# EAGLE design GBMx4-CPU (EAGLE 5.10)
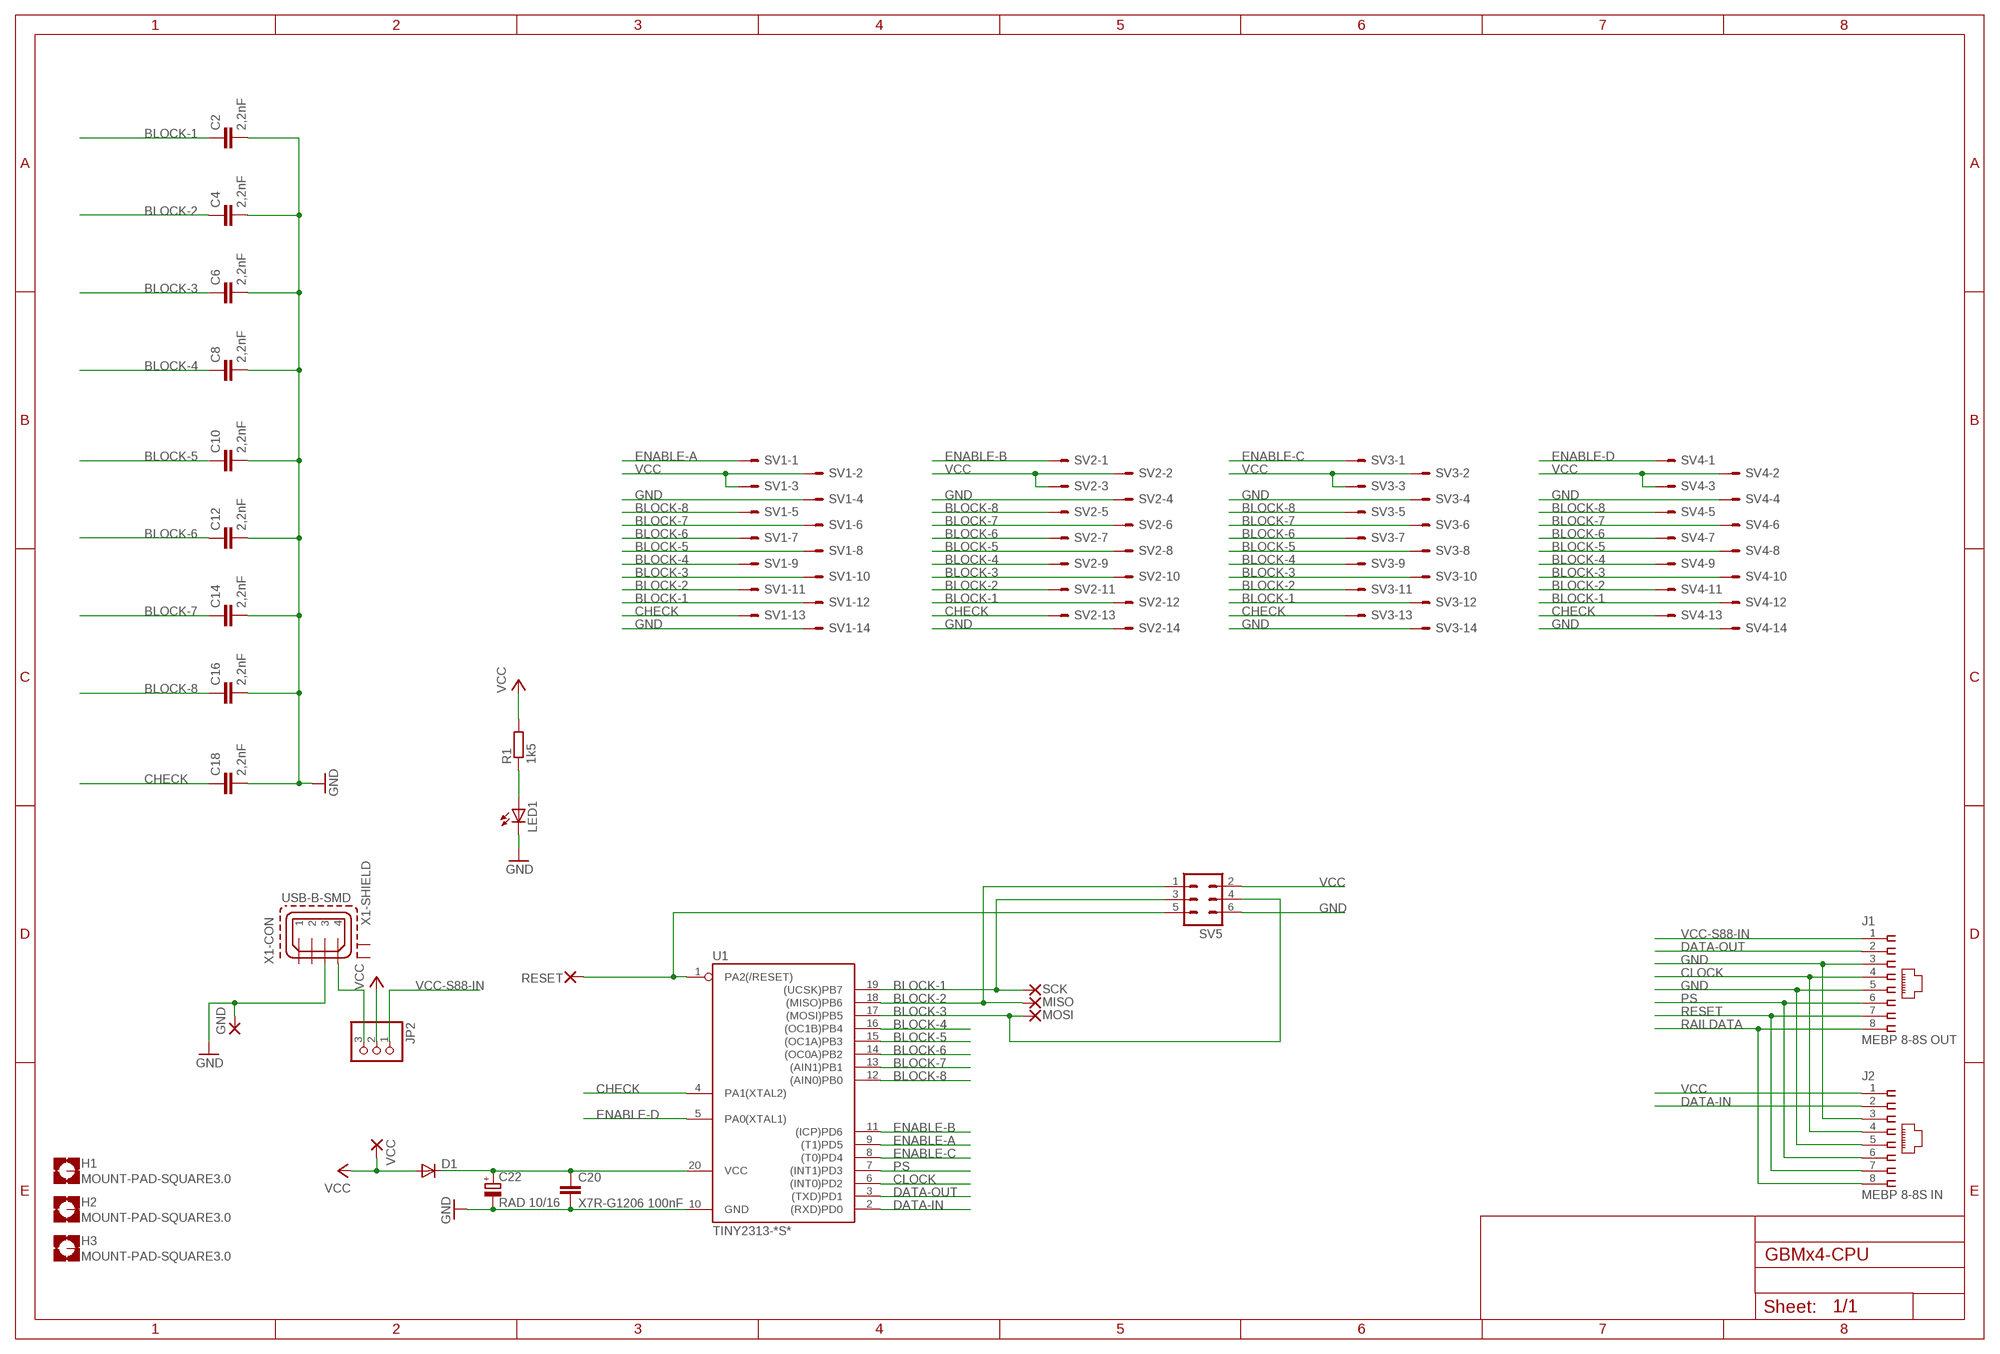
[diagram p0: schematic, sheet 1]

## Parts
C2  2,2nF  C-EUC1206  [C1206]
C4  2,2nF  C-EUC1206  [C1206]
C6  2,2nF  C-EUC1206  [C1206]
C8  2,2nF  C-EUC1206  [C1206]
C10  2,2nF  C-EUC1206  [C1206]
C12  2,2nF  C-EUC1206  [C1206]
C14  2,2nF  C-EUC1206  [C1206]
C16  2,2nF  C-EUC1206  [C1206]
C18  2,2nF  C-EUC1206  [C1206]
C20  X7R-G1206 100nF  C-EUC1206  [C1206]
C22  RAD 10/16  CPOL-EUE2.5-6  [E2,5-6]
D1  DIODE-MINIMELF  [MINIMELF]
GND  SMD2  [SMD1,27-2,54]
H1  MOUNT-PAD-SQUARE3.0  [3,0-PAD-SQUARE]
H2  MOUNT-PAD-SQUARE3.0  [3,0-PAD-SQUARE]
H3  MOUNT-PAD-SQUARE3.0  [3,0-PAD-SQUARE]
J1  MEBP 8-8S OUT  555162-1  [555162-1]
J2  MEBP 8-8S IN  555162-1  [555162-1]
JP2  PINHD-1X3  [1X03]
LED1  LED3MM  [LED3MM]
MISO  SMD2  [SMD1,27-2,54]
MOSI  SMD2  [SMD1,27-2,54]
R1  1k5  R-EU_R1206  [R1206]
RESET  SMD2  [SMD1,27-2,54]
SCK  SMD2  [SMD1,27-2,54]
SV1  ML14E  [ML14]
SV2  ML14E  [ML14]
SV3  ML14E  [ML14]
SV4  ML14E  [ML14]
SV5  ML6  [ML6]
U1  TINY2313-*S*  [SO20L$]
VCC  SMD2  [SMD1,27-2,54]
X1  USB-B-SMD  [USB-B-SMD]

## Nets
BLOCK-1: C2.1 SCK.1(P) SV1.12 SV2.12 SV3.12 SV4.12 SV5.3 U1.19((UCSK)PB7)
BLOCK-2: C4.1 MISO.1(P) SV1.11 SV2.11 SV3.11 SV4.11 SV5.1 U1.18((MISO)PB6)
BLOCK-3: C6.1 MOSI.1(P) SV1.10 SV2.10 SV3.10 SV4.10 SV5.4 U1.17((MOSI)PB5)
BLOCK-4: C8.1 SV1.9 SV2.9 SV3.9 SV4.9 U1.16((OC1B)PB4)
BLOCK-5: C10.1 SV1.8 SV2.8 SV3.8 SV4.8 U1.15((OC1A)PB3)
BLOCK-6: C12.1 SV1.7 SV2.7 SV3.7 SV4.7 U1.14((OC0A)PB2)
BLOCK-7: C14.1 SV1.6 SV2.6 SV3.6 SV4.6 U1.13((AIN1)PB1)
BLOCK-8: C16.1 SV1.5 SV2.5 SV3.5 SV4.5 U1.12((AIN0)PB0)
CHECK: C18.1 SV1.13 SV2.13 SV3.13 SV4.13 U1.4(PA1(XTAL2))
CLOCK: J1.4 J2.4 U1.6((INT0)PD2)
DATA-IN: J2.2 U1.2((RXD)PD0)
DATA-OUT: J1.2 U1.3((TXD)PD1)
ENABLE-A: SV1.1 U1.9((T1)PD5)
ENABLE-B: SV2.1 U1.11((ICP)PD6)
ENABLE-C: SV3.1 U1.8((T0)PD4)
ENABLE-D: SV4.1 U1.5(PA0(XTAL1))
GND: C2.2 C4.2 C6.2 C8.2 C10.2 C12.2 C14.2 C16.2 C18.2 C20.2 C22.- GND.1(P) J1.3 J1.5 J2.3 J2.5 LED1.K(C) SV1.4 SV1.14 SV2.4 SV2.14 SV3.4 SV3.14 SV4.4 SV4.14 SV5.6 U1.10(GND) X1.3
N$1: RESET.1(P) SV5.5 U1.1(PA2(/RESET))
N$2: LED1.A R1.1
N$8: C20.1 C22.+ D1.C U1.20(VCC)
PS: J1.6 J2.6 U1.7((INT1)PD3)
RAILDATA: J1.8 J2.8
RESET: J1.7 J2.7
VCC: D1.A J2.1 JP2.2 R1.2 SV1.2 SV1.3 SV2.2 SV2.3 SV3.2 SV3.3 SV4.2 SV4.3 SV5.2 VCC.1(P)
VCC-EXT: JP2.3 X1.4
VCC-S88-IN: J1.1 JP2.1
Unconnected: H1.B3,0(MOUNT) H2.B3,0(MOUNT) H3.B3,0(MOUNT) X1.1 X1.2 X1.M1(-SHIELD:S1) X1.M2(-SHIELD:S2)

## Library data of the parts
C2 C4 C6 C8 C10 C12 C14 C16 C18 C20 = rcl:C-EU: CAPACITOR, European symbol
C22 = rcl:CPOL-EU: POLARIZED CAPACITOR, European symbol
D1 = diode:DIODE-: DIODE
GND MISO MOSI RESET SCK VCC = wirepad:SMD2: SMD PAD
H1-H3 = holes:MOUNT-PAD-SQUARE: MOUNTING PAD, square
J1 J2 = con-amp:555162-1: AMP connector
JP2 = pinhead:PINHD-1X3: PIN HEADER
LED1 = led:LED: LED OSRAM: - CHIPLED LG R971, LG N971, LY N971, LG Q971, LY Q971, LO R971, LY R971 LH N974, LH R974 LS Q976, LO Q976, LY Q976 LO Q996 - Hyper CHIPLED LW Q18S LB Q993, LB Q99A, LB R99A - SideLED LS A670, LO A670, LY A670, LG A670, LP A670 LB A673, LV A673, LT A673, LW A673 LH A674 LY A675 LS A676, LA A676, LO A676, LY A676, LW A676 LS A679, LY A679, LG A679 - Hyper Micro SIDELED® LS Y876, LA Y876, LO Y876, LY Y876 LT Y87S - SmartLED LW L88C, LW L88S LB L89C, LB L89S, LG L890 LS L89K, LO L89K, LY L89K LS L896, LA L896, LO L896, LY L896 - TOPLED LS T670, LO T670, LY T670, LG T670, LP T670 LSG T670, LSP T670, LSY T670, LOP T670, LYG T670 LG T671, LOG T671, LSG T671 LB T673, LV T673, LT T673, LW T673 LH T674 LS T676, LA T676, LO T676, LY T676, LB T676, LH T676, LSB T676, LW T676 LB T67C, LV T67C, LT T67C, LS T67K, LO T67K, LY T67K, LW E67C LS E67B, LA E67B, LO E67B, LY E67B, LB E67C, LV E67C, LT E67C LW T67C LS T679, LY T679, LG T679 LS T770, LO T770, LY T770, LG T770, LP T770 LB T773, LV T773, LT T773, LW T773 LH T774 LS E675, LA E675, LY E675, LS T675 LS T776, LA T776, LO T776, LY T776, LB T776 LHGB T686 LT T68C, LB T68C - Hyper Mini TOPLED® LB M676 - Mini TOPLED Santana® LG M470 LS M47K, LO M47K, LY M47K Source: http://www.osram.convergy.de LUXEON: - LUMILED® LXK2-PW12-R00, LXK2-PW12-S00, LXK2-PW14-U00, LXK2-PW14-V00 LXK2-PM12-R00, LXK2-PM12-S00, LXK2-PM14-U00 LXK2-PE12-Q00, LXK2-PE12-R00, LXK2-PE12-S00, LXK2-PE14-T00, LXK2-PE14-U00 LXK2-PB12-K00, LXK2-PB12-L00, LXK2-PB12-M00, LXK2-PB14-N00, LXK2-PB14-P00, LXK2-PB14-Q00 LXK2-PR12-L00, LXK2-PR12-M00, LXK2-PR14-Q00, LXK2-PR14-R00 LXK2-PD12-Q00, LXK2-PD12-R00, LXK2-PD12-S00 LXK2-PH12-R00, LXK2-PH12-S00 LXK2-PL12-P00, LXK2-PL12-Q00, LXK2-PL12-R00 Source: www.luxeon.com KINGBRIGHT: KA-3528ASYC Source: www.kingbright.com
R1 = rcl:R-EU_: RESISTOR, European symbol
SV1-SV4 = con-ml:ML14E: HARTING
SV5 = con-ml:ML6: HARTING
U1 = avr-6:TINY2313*: Atmel Tiny2313 2K Flash, 128 bytes EEPROM, 128 bytes RAM
X1 = 1_USER:USB-B-SMD

## Board
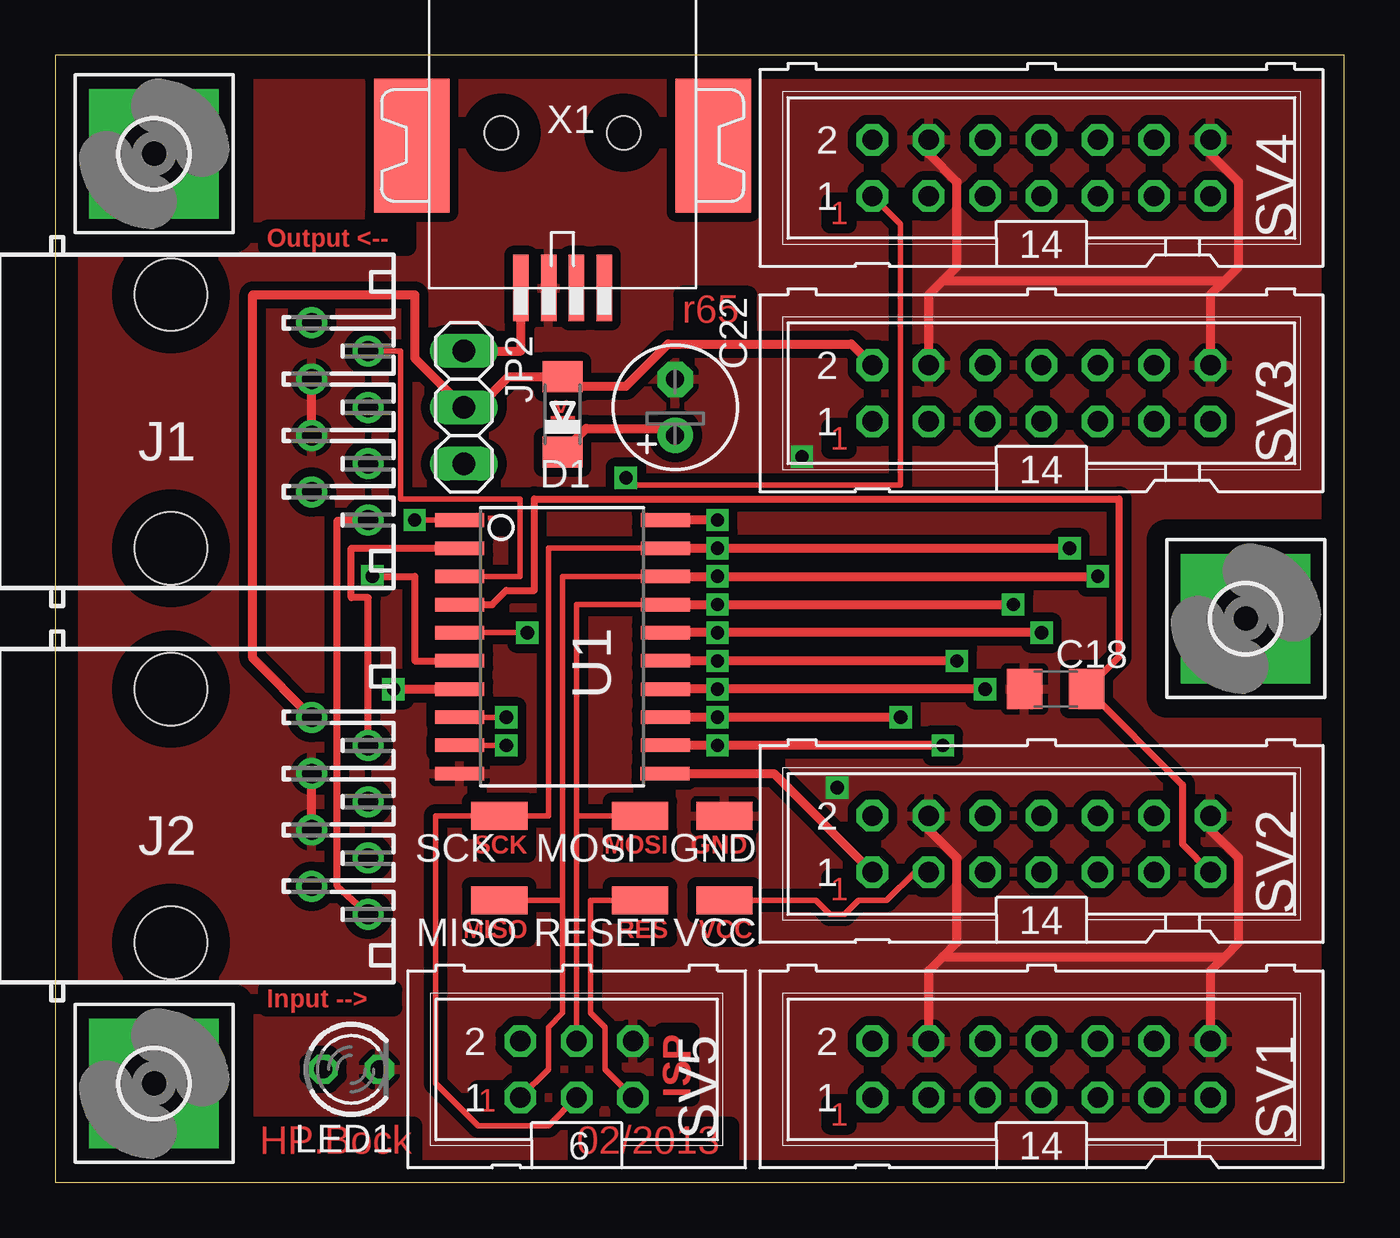
[diagram p1: board, top side]
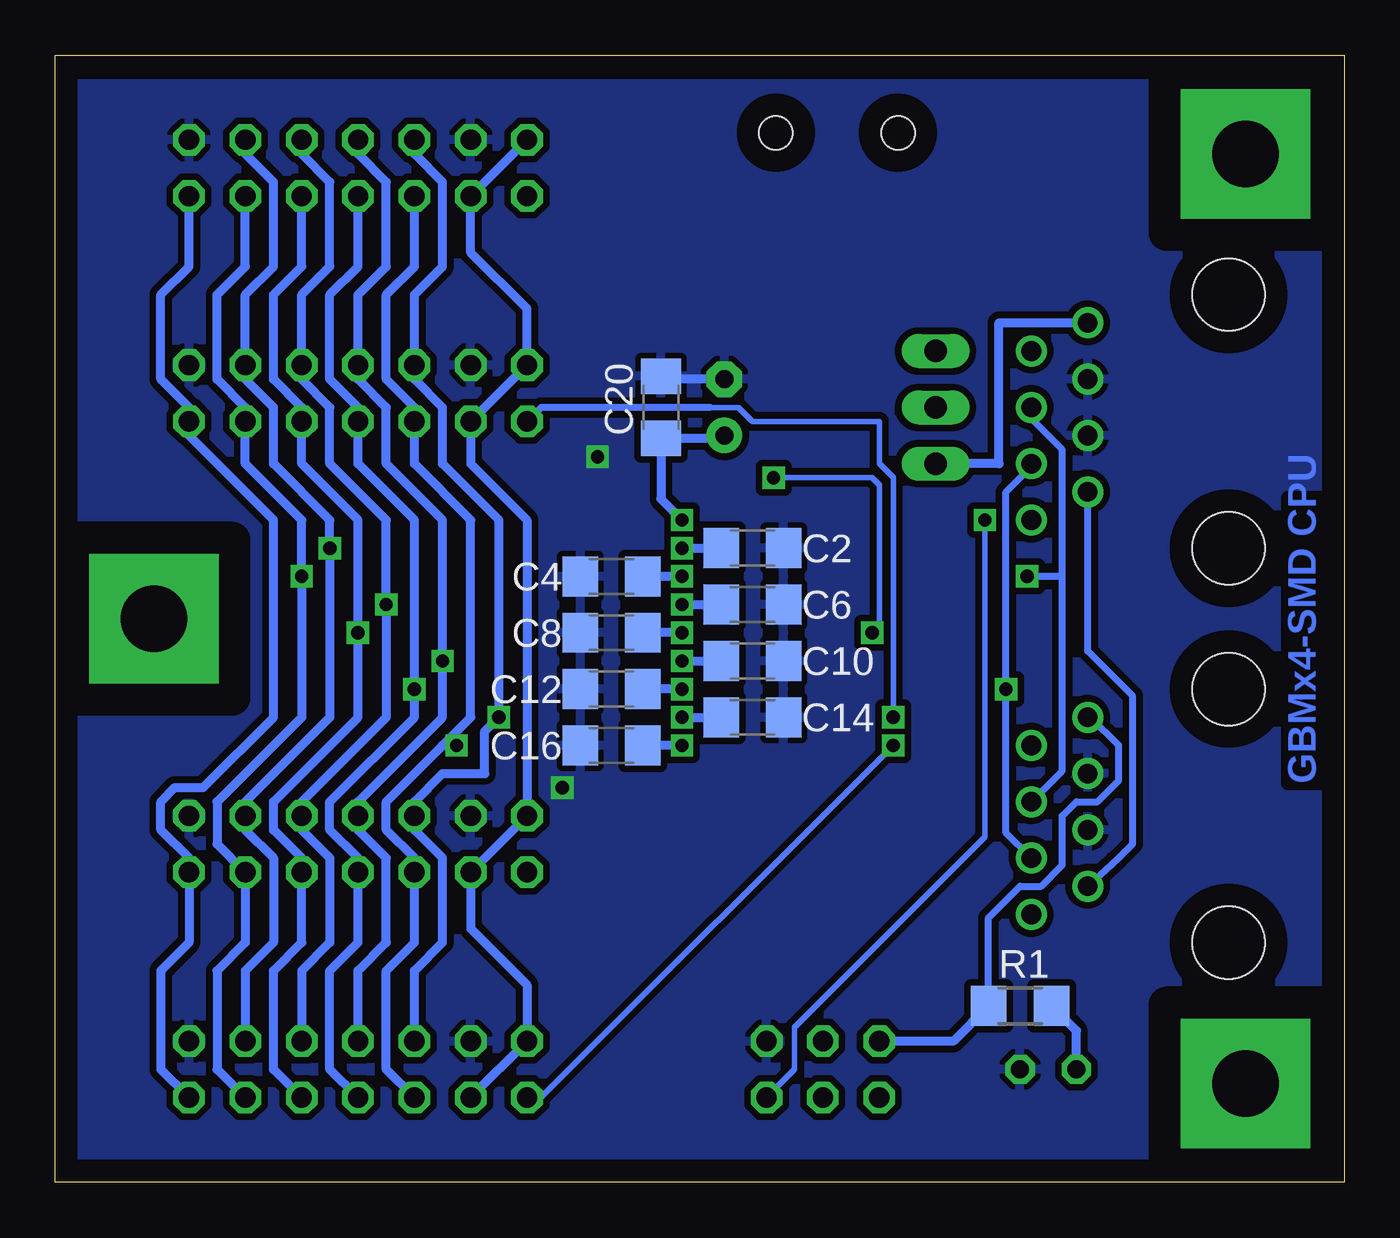
[diagram p2: board, bottom side, seen from below]

Size 58.09 x 50.79 mm. Coordinates in mm from the lower left corner, seen from the top.
Outline: 0,0 58.09,0 58.09,50.79 0,50.79 0,0
Copper layers (1*16): Top 0.035mm / dielectric 1.5mm / Bottom 0.035mm
Design rules "Bilex DRU": minimum track width 10mil, minimum drill 24mil, track to track 10mil, track to pad 10mil, pad to pad 10mil, via to via 10mil, smd to smd 10mil, copper to edge 40mil, drill to drill 8mil, minimum pad ring 10mil, minimum via ring 8mil, stop-mask expansion 4mil, vias tented up to drill 0mil, thermal gap 10mil

### Footprints (pad centres in the part's own frame; a part is rotated, then mirrored left to right if it is on the bottom)
C1206 = smd 1.6 x 1.8: 1 -1.4,0; 2 1.4,0
E2,5-6 = drill 0.813 pad 1.6 round: + -1.27,0 | drill 0.813 pad 1.6 octagon: - 1.27,0
MINIMELF = smd 1.4 x 1.8: A 1.7,0; C -1.7,0
SMD1,27-2,54 = smd 1.27 x 2.54: 1 0,0
3,0-PAD-SQUARE = drill 3 pad 5.842 square: B3,0 0,0
555162-1 = drill 0.889 round: 1 -4.445,5.207; 2 -3.175,7.747; 3 -1.905,5.207; 4 -0.635,7.747; 5 0.635,5.207; 6 1.905,7.747; 7 3.175,5.207; 8 4.445,7.747 | hole 3.251: -5.715,-1.143; 5.715,-1.143
1X03 = drill 1.016 long: 1 -2.54,0; 2 0,0; 3 2.54,0
LED3MM = drill 0.813 octagon: A -1.27,0; K 1.27,0
R1206 = smd 1.6 x 1.803: 1 -1.422,0; 2 1.422,0
ML14 = drill 0.914 octagon: 1 -7.62,-1.27; 2 -7.62,1.27; 3 -5.08,-1.27; 4 -5.08,1.27; 5 -2.54,-1.27; 6 -2.54,1.27; 7 0,-1.27; 8 0,1.27; 9 2.54,-1.27; 10 2.54,1.27; 11 5.08,-1.27; 12 5.08,1.27; 13 7.62,-1.27; 14 7.62,1.27
ML6 = drill 0.914 octagon: 1 -2.54,-1.27; 2 -2.54,1.27; 3 0,-1.27; 4 0,1.27; 5 2.54,-1.27; 6 2.54,1.27
SO20L$ = smd 0.61 x 2.21: 1 -5.715,-4.636; 2 -4.445,-4.636; 3 -3.175,-4.636; 4 -1.905,-4.636; 5 -0.635,-4.636; 6 0.635,-4.636; 7 1.905,-4.636; 8 3.175,-4.636; 9 4.445,-4.636; 10 5.715,-4.636; 11 5.715,4.61; 12 4.445,4.636; 13 3.175,4.636; 14 1.905,4.636; 15 0.635,4.636; 16 -0.635,4.636; 17 -1.905,4.636; 18 -3.175,4.636; 19 -4.445,4.636; 20 -5.715,4.636
USB-B-SMD = smd 3 x 0.7: 1 7,1.875; 2 7,0.625; 3 7,-0.625; 4 7,-1.875 | smd 6.04 x 3.4: M1 0.58,-6.8; M2 0.58,6.8 | hole 1.5: 0,-2.75; 0,2.75

### Placement (x,y rotation side)
C2  26.67,28.57 0 bottom
C4  33.02,27.3 180 bottom
C6  26.67,26.04 0 bottom
C8  33.02,24.77 180 bottom
C10  26.67,23.5 0 bottom
C12  33.02,22.23 180 bottom
C14  26.67,20.95 0 bottom
C16  33.02,19.68 180 bottom
C18  45.09,22.23 180 top
C20  30.8,34.92 90 bottom
C22  27.94,34.92 90 top
D1  22.86,34.61 90 top
GND  30.16,16.51 90 top
H1  4.45,46.35 0 top
H2  53.66,25.4 0 top
H3  4.45,4.45 0 top
J1  6.35,34.29 270 top
J2  6.35,16.51 270 top
JP2  18.41,34.92 90 top
LED1  13.34,5.08 0 top
MISO  20,12.7 90 top
MOSI  26.35,16.51 90 top
R1  14.61,7.94 180 bottom
RESET  26.35,12.7 90 top
SCK  20,16.51 90 top
SV1  44.45,5.08 0 top
SV2  44.45,15.24 0 top
SV3  44.45,35.56 0 top
SV4  44.45,45.72 0 top
SV5  23.5,5.08 0 top
U1  22.86,24.13 270 top
VCC  30.16,12.7 90 top
X1  22.86,47.31 270 top

### Tracks (layer width: path | path; a pad name or v marks a point on that pad's centre or on a via)
BLOCK-1  (via drill 0.6)
  Top 0.254: U1.19 22.23,28.57 22.23,16.51 SCK.1 17.14,16.51 17.14,4.45 19.05,2.54 22.23,2.54 SV5.3
  Top 0.406: U1.19 v29.84,28.57 v45.72,28.57
  Bottom 0.406: SV1.12 49.53,9.53 48.26,10.79 48.26,14.61 49.53,15.88 SV2.12 49.53,17.14 45.72,20.95 v45.72,28.57 45.72,29.84 48.26,32.38 48.26,34.92 49.53,36.2 SV3.12 49.53,40.01 48.26,41.27 48.26,45.09 49.53,46.35 SV4.12 | v29.84,28.57 C2.1
BLOCK-2  (via drill 0.6)
  Top 0.254: U1.18 22.86,27.3 22.86,12.7 | 22.86,12.7 22.86,7.62 22.23,6.99 22.23,5.08 SV5.1 | 22.86,12.7 MISO.1
  Top 0.406: U1.18 v29.84,27.3 v46.99,27.3
  Bottom 0.406: SV1.11 50.8,5.08 50.8,9.53 49.53,10.79 SV2.11 50.8,15.24 50.8,17.14 46.99,20.95 v46.99,27.3 46.99,29.84 49.53,32.38 SV3.11 49.53,34.92 50.8,36.2 50.8,40.01 49.53,41.27 SV4.11 | v29.84,27.3 C4.1
BLOCK-3  (via drill 0.6)
  Top 0.254: U1.17 23.5,26.04 23.5,16.51 | SV5.4 23.5,16.51 | 23.5,16.51 MOSI.1
  Top 0.406: U1.17 v29.84,26.04 v43.18,26.04
  Bottom 0.406: SV1.10 46.99,9.53 45.72,10.79 45.72,14.61 46.99,15.88 SV2.10 46.99,17.14 43.18,20.95 v43.18,26.04 43.18,29.84 45.72,32.38 45.72,34.92 46.99,36.2 SV3.10 46.99,40.01 45.72,41.27 45.72,45.09 46.99,46.35 SV4.10 | v29.84,26.04 C6.1
BLOCK-4  (via drill 0.6)
  Top 0.406: U1.16 v29.84,24.77 v44.45,24.77
  Bottom 0.406: SV1.9 48.26,5.08 48.26,9.53 46.99,10.79 SV2.9 46.99,14.61 48.26,15.88 48.26,17.14 44.45,20.95 v44.45,24.77 44.45,29.84 46.99,32.38 SV3.9 46.99,34.92 48.26,36.2 48.26,40.01 46.99,41.27 SV4.9 | v29.84,24.77 C8.1
BLOCK-5  (via drill 0.6)
  Top 0.406: U1.15 v29.84,23.5 v40.64,23.5
  Bottom 0.406: SV1.8 44.45,9.53 43.18,10.79 43.18,14.61 44.45,15.88 SV2.8 44.45,17.14 40.64,20.95 v40.64,23.5 40.64,29.84 43.18,32.38 43.18,34.92 44.45,36.2 SV3.8 44.45,40.01 43.18,41.27 43.18,45.09 44.45,46.35 SV4.8 | v29.84,23.5 C10.1
BLOCK-6  (via drill 0.6)
  Top 0.406: U1.14 v29.84,22.23 v41.91,22.23
  Bottom 0.406: SV1.7 45.72,5.08 45.72,9.53 44.45,10.79 SV2.7 44.45,14.61 45.72,15.88 45.72,17.14 41.91,20.95 v41.91,22.23 41.91,29.84 44.45,32.38 SV3.7 44.45,34.92 45.72,36.2 45.72,40.01 44.45,41.27 SV4.7 | v29.84,22.23 C12.1
BLOCK-7  (via drill 0.6)
  Top 0.406: U1.13 v29.84,20.95 v38.1,20.95
  Bottom 0.406: SV1.6 41.91,9.53 40.64,10.79 40.64,14.61 41.91,15.88 SV2.6 41.91,17.14 40.64,18.41 38.73,18.41 38.73,20.32 v38.1,20.95 38.1,29.84 40.64,32.38 40.64,34.92 41.91,36.2 SV3.6 41.91,40.01 40.64,41.27 40.64,45.09 41.91,46.35 SV4.6 | v29.84,20.95 C14.1
BLOCK-8  (via drill 0.6)
  Top 0.406: U1.12 v29.84,19.68 v40.01,19.68
  Bottom 0.406: SV1.5 43.18,5.08 43.18,9.53 41.91,10.79 SV2.5 41.91,14.61 43.18,15.88 43.18,17.14 40.64,19.68 | SV4.5 41.91,41.27 43.18,40.01 43.18,36.2 41.91,34.92 SV3.5 41.91,32.38 39.37,29.84 39.37,20.95 40.64,19.68 | v29.84,19.68 C16.1 | 40.64,19.68 v40.01,19.68
CHECK
  Top 0.305: U1.4 19.68,26.04 20.32,26.67 21.59,26.67 21.59,30.8 47.94,30.8 47.94,23.68 C18.1 50.8,17.91 50.8,15.24 SV2.13
  Bottom 0.406: SV1.13 53.34,5.08 53.34,9.53 52.07,10.79 SV2.13 52.07,14.61 53.34,15.88 53.34,17.14 52.7,17.78 51.44,17.78 48.26,20.95 48.26,29.84 52.07,33.66 SV3.13 52.07,34.92 53.34,36.2 53.34,40.01 52.07,41.27 SV4.13
CLOCK  (via drill 0.6)
  Top 0.305: v14.29,27.3 16.19,27.3 16.19,23.5 U1.6
  Bottom 0.305: J2.4 12.7,18.54 12.7,27.3 | 12.7,27.3 12.7,33.02 14.1,34.42 J1.4 | 12.7,27.3 v14.29,27.3
DATA-IN
  Top 0.305: J2.2 14.1,26.35 13.34,26.35 13.34,28.57 U1.2
DATA-OUT
  Top 0.254: J1.2 15.56,37.47 15.56,30.8 20.95,30.8 20.95,27.3 U1.3
ENABLE-A  (via drill 0.6)
  Top 0.254: U1.9 v20.32,19.68
  Bottom 0.254: v20.32,19.68 36.2,3.81 SV1.1
ENABLE-B
  Top 0.406: SV2.1 32.38,18.41 U1.11
ENABLE-C  (via drill 0.6)
  Top 0.254: U1.8 v20.32,20.95
  Bottom 0.254: 28.57,34.92 27.3,34.92 26.67,34.29 20.95,34.29 20.95,32.38 20.32,31.75 v20.32,20.95
  Bottom 0.305: 28.57,34.92 36.2,34.92 SV3.1
ENABLE-D  (via drill 0.6)
  Top 0.254: SV4.1 38.1,43.18 38.1,31.43 26.04,31.43 v25.72,31.75 | U1.5 v21.27,24.77
  Bottom 0.254: v21.27,24.77 20.95,25.08 20.95,31.43 21.27,31.75 v25.72,31.75
GND  (via drill 0.6)
  Top 0.406: SV1.4 39.37,9.53 40.01,10.16 | SV2.4 39.37,15.88 40.64,14.61 40.64,10.79 40.01,10.16 | SV1.14 52.07,9.53 52.7,10.16 | SV2.14 52.07,15.88 53.34,14.61 53.34,10.79 52.7,10.16 | 40.01,10.16 52.7,10.16 | 40.01,40.64 40.64,41.27 40.64,45.09 39.37,46.35 SV4.4 | SV3.14 52.07,40.01 52.7,40.64 | 40.01,40.64 52.7,40.64 | 40.01,40.64 39.37,40.01 SV3.4 | 52.7,40.64 53.34,41.27 53.34,45.09 52.07,46.35 SV4.14 | J1.5 J1.3 | J2.5 J2.3
  Bottom 0.406: C22.- 30.8,36.2 C20.2
  other vias: 35.24,17.78 33.66,32.7
  pour Bottom (isolate 0.305, rank 2): 0,0 58.1,0 58.1,49.53 0,49.53
  pour Top (isolate 0.406): 0,0 0,49.53 58.1,49.53 58.1,0
N$1  (via drill 0.6)
  Top 0.254: v16.19,29.84 U1.1 | RESET.1 24.13,12.7 24.13,7.62 24.77,6.99 24.77,5.08 SV5.5
  Bottom 0.254: v16.19,29.84 16.19,15.56 24.77,6.99 24.77,5.08 SV5.5
N$2
  Bottom 0.406: R1.1 12.06,6.82 LED1.A
N$8  (via drill 0.6)
  Top 0.406: v29.84,29.84 U1.20 | D1.C 23.93,33.97 27.62,33.97 C22.+
  Bottom 0.406: v29.84,29.84 30.8,30.8 C20.1 28.07,33.52 C22.+
PS  (via drill 0.6)
  Top 0.406: v15.24,22.23 U1.7
  Bottom 0.305: J2.6 15.24,15.75 v15.24,22.23 15.24,31.11 14.1,32.26 J1.6
RAILDATA
  Top 0.305: J1.8 12.7,29.84 12.7,13.34 J2.8
RESET
  Bottom 0.305: J2.7 10.16,14.61 9.53,15.24 9.53,21.91 11.56,23.94 J1.7
VCC
  Top 0.254: VCC.1 34.29,12.7 34.92,12.06 35.56,12.06 36.2,12.7 37.47,12.7 38.73,13.97 SV2.3
  Top 0.406: SV3.2 35.88,37.78 27.62,37.78 25.72,35.88 22.97,35.88 D1.A 20.43,36.31 19.05,34.92 JP2.2 16.19,37.15 16.19,40.01 8.89,40.01 8.89,23.62 J2.1
  Bottom 0.305: R1.2 16.03,11.91 14.61,13.34 13.65,13.34 12.7,14.29 12.7,16.51 12.06,17.14 11.11,17.14 10.16,18.1 10.16,19.68 11.43,20.95 J2.1
  Bottom 0.406: SV1.3 SV1.2 36.83,8.89 39.37,11.43 SV2.3 SV2.2 36.83,29.84 39.37,32.38 SV3.3 SV3.2 36.83,39.37 39.37,41.91 SV4.3 SV4.2 | SV5.2 17.61,6.35 R1.2
VCC-EXT
  Top 0.406: X1.4 20.98,37.47 JP2.3
VCC-S88-IN
  Bottom 0.406: J1.1 15.56,38.73 15.56,32.38 JP2.1

### Text on the board
Top: 1 | Output <-- | r65 | |< | 1 | · | SCK | MOSI | GND | 1 | MISO | RES | VCC | Input --> | ISP | 1 | 1 | HP.Bock | 02/2013
Bottom: GBMx4-SMD CPU